# Altium project UPS.PrjPCB
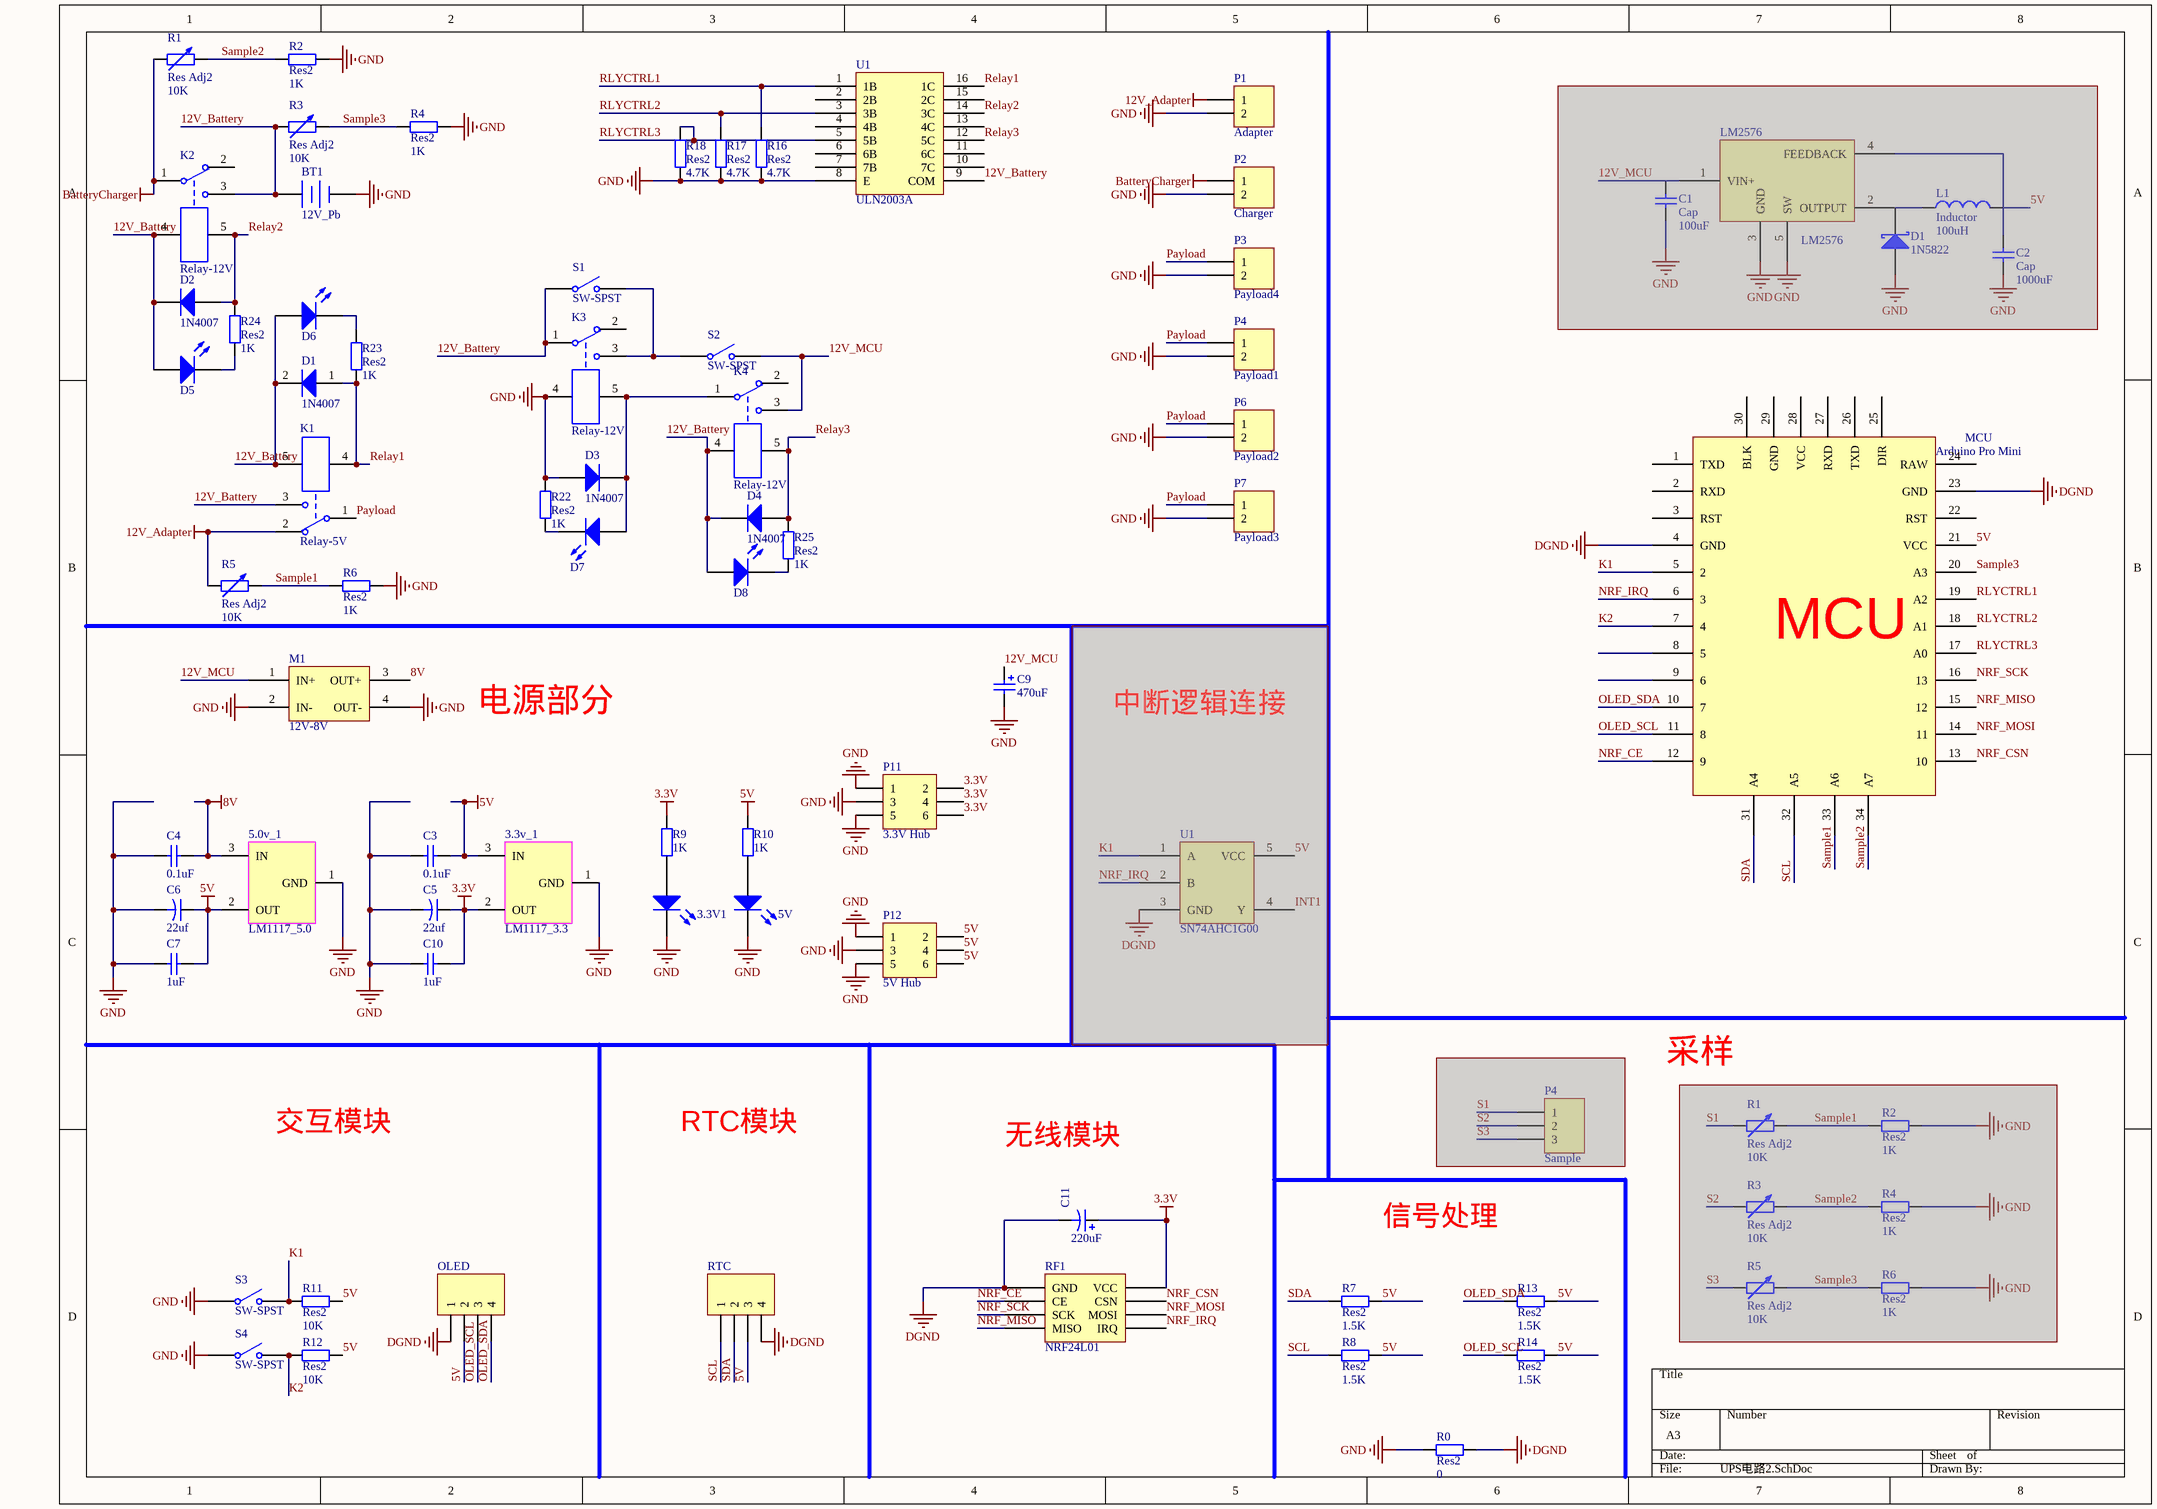
[diagram p0: UPS电路2.SchDoc]
1 sheet, 78 parts. Net scope: global (net labels, ports and power ports of the same name join across sheets).
Board file: UPS电路3.PcbDoc

## Sheet UPS电路2.SchDoc
size A3

### Parts
(Parts that share a designator on the sheet are numbered #1, #2 ... from top to bottom, then left to right.)
3.3V1  3.3V1  [LED]  (value not drawn)
3.3v_1  LM1117_3.3  [LC-SOT-223]
5.0v_1  LM1117_5.0  [LC-SOT-223]
5V  3.3V1  [LED]  (value not drawn)
BT1  12V_Pb  [BIG2]
C1  Cap  value 100uF  [RAD-0.3]  (masked out: inside a compile mask, not in the netlist)
C2  Cap  value 1000uF  [RAD-0.3]  (masked out: inside a compile mask, not in the netlist)
C3  0.1uF  [0805]
C4  0.1uF  [0805]
C5  22uf  [LC-CASE-B_3528]
C6  22uf  [LC-CASE-B_3528]
C7  1uF  [0805]
C9  470uF  [470uf-2]
C10  1uF  [0805]
C11  220uF  [220uf]
D1#1  1N5822  [TO-220AC]  (masked out: inside a compile mask, not in the netlist)
D1#2  1N4007  [m7(1n4007)]
D2  1N4007  [m7(1n4007)]
D3  1N4007  [m7(1n4007)]
D4  1N4007  [m7(1n4007)]
D5  3.3V1  [LED]  (value not drawn)
D6  3.3V1  [LED]  (value not drawn)
D7  3.3V1  [LED]  (value not drawn)
D8  3.3V1  [LED]  (value not drawn)
K1  Relay-5V  [SRD_12VDC_SL_C]
K2  Relay-12V  [SRD_12VDC_SL_C]
K3  Relay-12V  [SRD_12VDC_SL_C]
K4  Relay-12V  [SRD_12VDC_SL_C]
L1  Inductor  value 100uH  [0402-A]  (masked out: inside a compile mask, not in the netlist)
LM2576  LM2576  (masked out: inside a compile mask, not in the netlist)
M1  12V-8V  [LM2596]
MCU  Arduino Pro Mini  [Arduino_Promini]
OLED  Header 4  [HDR1X4]  (value not drawn)
P1  Adapter  [BIG2]
P2  Charger  [BIG2]
P3  Payload4  [BIG2]
P4#1  Payload1  [BIG2]
P4#2  Sample  [HDR1X3]  (masked out: inside a compile mask, not in the netlist)
P6  Payload2  [BIG2]
P7  Payload3  [BIG2]
P11  3.3V Hub  [HDR2X3]
P12  5V Hub  [HDR2X3]
R0  Res2  value 0  [0805]
R1#1  Res Adj2  value 10K  [0805]
R1#2  Res Adj2  value 10K  [AdjRes]  (masked out: inside a compile mask, not in the netlist)
R2#1  Res2  value 1K  [0805]
R2#2  Res2  value 1K  [0805]  (masked out: inside a compile mask, not in the netlist)
R3#1  Res Adj2  value 10K  [0805]
R3#2  Res Adj2  value 10K  [AdjRes]  (masked out: inside a compile mask, not in the netlist)
R4#1  Res2  value 1K  [0805]
R4#2  Res2  value 1K  [0805]  (masked out: inside a compile mask, not in the netlist)
R5#1  Res Adj2  value 10K  [0805]
R5#2  Res Adj2  value 10K  [AdjRes]  (masked out: inside a compile mask, not in the netlist)
R6#1  Res2  value 1K  [0805]
R6#2  Res2  value 1K  [0805]  (masked out: inside a compile mask, not in the netlist)
R7  Res2  value 1.5K  [0805]
R8  Res2  value 1.5K  [0805]
R9  1K  [0805]
R10  1K  [0805]
R11  Res2  value 10K  [0805]
R12  Res2  value 10K  [0805]
R13  Res2  value 1.5K  [0805]
R14  Res2  value 1.5K  [0805]
R16  Res2  value 4.7K  [0805]
R17  Res2  value 4.7K  [0805]
R18  Res2  value 4.7K  [0805]
R22  Res2  value 1K  [0805]
R23  Res2  value 1K  [0805]
R24  Res2  value 1K  [0805]
R25  Res2  value 1K  [0805]
RF1  NRF24L01  [NRF24L01]
RTC  Header 4  [HDR1X4]  (value not drawn)
S1  SW-SPST  [SWITCH6*6*5]
S2  SW-SPST  [Swtich7*7]
S3  SW-SPST  [SWITCH6*6*5]
S4  SW-SPST  [SWITCH6*6*5]
U1#1  ULN2003A  [ULN2003-DIP16]
U1#2  SN74AHC1G00  (masked out: inside a compile mask, not in the netlist)

### Nets
3.3V: 3.3v_1.2(OUT) C5.1 C10.2 C11.1 P11.2 P11.4 P11.6 R9.2 RF1.2(VCC)
5V: 3.3v_1.3(IN) 5.0v_1.2(OUT) C3.2 C6.1 C7.2 MCU.21(VCC) OLED.2 P12.2 P12.4 P12.6 R7.2 R8.2 R10.2 R11.1 R12.1 R13.2 R14.2 RTC.3
8V: 5.0v_1.3(IN) C4.2 M1.3(OUT+)
12V_Adapter: K1.2 P1.1 R5#1.1
BatteryCharger: K2.1 P2.1 R1#1.1
DGND: C11.2 MCU.4(GND) MCU.23(GND) OLED.1 R0.2 RF1.1(GND) RTC.4
GND: 3.3V1.2(K) 3.3v_1.1(GND) 5.0v_1.1(GND) 5V.2(K) BT1.2(-) C3.1 C4.1 C5.2 C6.2 C7.1 C9.2 C10.1 D3.1(A) K3.4 M1.2(IN-) M1.4(OUT-) P1.2 P2.2 P3.2 P4#1.2 P6.2 P7.2 P11.1 P11.3 P11.5 P12.1 P12.3 P12.5 R0.1 R2#1.2 R4#1.2 R6#1.2 R16.1 R17.1 R18.1 R22.2 S3.1(COMMON) S4.1(COMMON) U1#1.8(E)
12V_Battery: BT1.1(+) D1#2.2(K) D2.2(K) D4.2(K) D5.1(A) D6.1(A) D8.1(A) K1.3 K1.5 K2.3 K2.4 K3.1 K4.4 R3#1.1 S1.1(COMMON) U1#1.9(COM)
12V_MCU: C9.1 K4.3 M1.1(IN+) S2.2(NO)
K1: MCU.5(2) R11.2 S3.2(NO)
K2: MCU.7(4) R12.2 S4.2(NO)
NRF_CE: MCU.12(9) RF1.3(CE)
NRF_CSN: MCU.13(10) RF1.4(CSN)
NRF_IRQ: MCU.6(3) RF1.8(IRQ)
NRF_MISO: MCU.15(12) RF1.7(MISO)
NRF_MOSI: MCU.14(11) RF1.6(MOSI)
NRF_SCK: MCU.16(13) RF1.5(SCK)
OLED_SCL: MCU.11(8) OLED.3 R14.1
OLED_SDA: MCU.10(7) OLED.4 R13.1
Payload: K1.1 P3.1 P4#1.1 P6.1 P7.1
Relay1: D1#2.1(A) K1.4 R23.1 U1#1.16(1C)
Relay2: D2.1(A) K2.5 R24.2 U1#1.14(3C)
Relay3: D4.1(A) K4.5 R25.2 U1#1.12(5C)
RLYCTRL1: MCU.19(A2) R16.2 U1#1.1(1B)
RLYCTRL2: MCU.18(A1) R17.2 U1#1.3(3B)
RLYCTRL3: MCU.17(A0) R18.2 U1#1.5(5B)
Sample1: MCU.33(A6) R5#1.2 R6#1.1
Sample2: MCU.34(A7) R1#1.2 R2#1.1
Sample3: MCU.20(A3) R3#1.2 R4#1.1
SCL: MCU.32(A5) R8.1 RTC.1
SDA: MCU.31(A4) R7.1 RTC.2
Net3.3V1_1: 3.3V1.1(A) R9.1
Net5V_1: 5V.1(A) R10.1
NetD3_2: D3.2(K) D7.1(A) K3.5 K4.1
NetD5_2: D5.2(K) R24.1
NetD6_2: D6.2(K) R23.2
NetD7_2: D7.2(K) R22.1
NetD8_2: D8.2(K) R25.1
NetK3_3: K3.3 S1.2(NO) S2.1(COMMON)

Not connected (* = marked no-connect by the designer): K2 2; K3 2; K4 2; MCU 1(TXD) 2(RXD) 3(RST) 8(5) 9(6) 22(RST) 24(RAW) 25(DIR) 26(TXD) 27(RXD) 28(VCC) 29(GND) 30(BLK); U1#1 2(2B) 4(4B) 6(6B) 7(7B) 10(7C) 11(6C) 13(4C) 15(2C)

### Notes on the sheet
- (near MCU) MCU
- 电源部分
- 中断逻辑连接
- 采样
- 交互模块
- RTC模块
- 无线模块
- 信号处理

### Library data of the parts
3.3V1 5V D5-D8 = LED: Typical RED, GREEN, YELLOW, AMBER GaAs LED; Published: 8-Jun-2000; LatestRevisionDate: 17-Jul-2002; LatestRevisionNote: Re-released for DXP Platform.; PackageDocument: Feb-2002; PackageReference: 3.2X1.6X1.1; Publisher: Altium Limited
3.3v_1 5.0v_1 = LM1117
BT1 = Battery: Multicell Battery; Published: 24-Mar-1999; LatestRevisionDate: 17-Jul-2002; LatestRevisionNote: Re-released for DXP Platform.; PackageReference: BAT-2; Publisher: Altium Limited; PackageDescription: Battery; 2 Leads
C1 C2 = Cap: Capacitor; Published: 8-Jun-2000; LatestRevisionDate: 17-Jul-2002; LatestRevisionNote: Re-released for DXP Platform.; PackageReference: RAD-0.3; Publisher: Altium Limited; PackageDescription: Radial Cap, Thru-Hole; 2 Leads; 0.3 in Pin Spacing
C3 C4 C7 C10 = cap: Capacitor
C5 C6 = Cap2: Capacitor; Value: 0.1uF; Published: 23-Sep-2002; Publisher: Altium Limited
C9 = Cap Pol2: Polarized Capacitor (Axial); Value: 47uF; Published: 8-Jun-2000; LatestRevisionDate: 17-Jul-2002; LatestRevisionNote: Re-released for DXP Platform.; Publisher: Altium Limited
C11 = Cap Pol1: Polarized Capacitor (Radial); Value: 10uF; Published: 8-Jun-2000; LatestRevisionDate: 17-Jul-2002; LatestRevisionNote: Re-released for DXP Platform.; Publisher: Altium Limited
D1#1 = Diode 10TQ035: Schottky Rectifier; Note: Terminal 2 is the TAB and is electrically connected to the cathode; Published: 8-Jun-2000; LatestRevisionDate: 17-Jul-2002; LatestRevisionNote: Re-released for DXP Platform.; DatasheetVersion: PD-2.057B; PackageVersion: Feb-1998; PackageReference: TO-220AC; Publisher: Altium Limited; PackageDescription: TO, Thru-Hole, Vertical, Heatsink Mounted; 3 In-Line Leads (1 Absent); Pitch 2.54 mm; ComponentLink1Description: Manufacturer Link; ComponentLink1URL: http://www.irf.com/; ComponentLink2Description: Datasheet; ComponentLink2URL: http://www.irf.com/product-info/datasheets/data/10tq.pdf
D1#2 D2-D4 = Diode 1N4007: 1 Amp General Purpose Rectifier; Published: 8-Jun-2000; LatestRevisionDate: 17-Jul-2002; LatestRevisionNote: Re-released for DXP Platform.; DatasheetVersion: 1998; PackageVersion: Aug-1999; PackageReference: DO-41; Publisher: Altium Limited; PackageDescription: Diode, Axial; Body 5.2 x 2.7 mm (LxDia. max), Lead Dia. 0.86 mm (max); Code_JEDEC: DO-204-AL; ComponentLink1Description: Manufacturer Link; ComponentLink1URL: http://www.fairchildsemi.com/; ComponentLink2Description: Datasheet; ComponentLink2URL: http://www.fairchildsemi.com/ds/1N%2F1N4001.pdf
K1-K4 = Relay-SPDT: Single-Pole Dual-Throw Relay; Published: 24-Mar-1999; LatestRevisionDate: 17-Jul-2002; LatestRevisionNote: Re-released for DXP Platform.; PackageReference: MODULE5B; Publisher: Altium Limited
L1 = Inductor: Code_IEC: 1005; Published: 8-Jun-2000; LatestRevisionDate: 29-May-2009; LatestRevisionNote: IPC-7351 Footprint Added.; PackageReference: 0402-A; Publisher: Altium Limited; PackageDescription: Chip Inductor; Code_JEITA: 0402
M1 = 12V-5V
OLED RTC = Header 4: Header, 4-Pin; LatestRevisionDate: 17-Jul-2002; LatestRevisionNote: Re-released for DXP Platform.; Publisher: Altium Limited
P1-P3 P4#1 P6 P7 = Header 2: Header, 2-Pin; LatestRevisionDate: 17-Jul-2002; LatestRevisionNote: Re-released for DXP Platform.; Publisher: Altium Limited
P4#2 = Header 3: Header, 3-Pin; LatestRevisionDate: 17-Jul-2002; LatestRevisionNote: Re-released for DXP Platform.; Publisher: Altium Limited
P11 P12 = Header 3X2: Header, 3-Pin, Dual row; LatestRevisionDate: 17-Jul-2002; LatestRevisionNote: Re-released for DXP Platform.; Publisher: Altium Limited
R0 R2#1 R2#2 R4#1 R4#2 R6#1 R6#2 R7 R8 R11-R14 R16-R18 R22-R25 = Res2: Resistor; Published: 8-Jun-2000; LatestRevisionDate: 17-Jul-2002; LatestRevisionNote: Re-released for DXP Platform.; PackageReference: AXIAL-0.4; Publisher: Altium Limited; PackageDescription: Axial Device, Thru-Hole; 2 Leads; 0.4 in Pin Spacing
R1#1 R1#2 R3#1 R3#2 R5#1 R5#2 = Res Adj2: Variable Resistor; Set Position: 0.5; Published: 8-Jun-2000; LatestRevisionDate: 17-Jul-2002; LatestRevisionNote: Re-released for DXP Platform.; PackageReference: AXIAL-0.6; Publisher: Altium Limited; PackageDescription: Axial Device, Thru-Hole; 2 Leads; 0.6 in Pin Spacing
R9 R10 = RES2_1: Resistor
S1-S4 = SW-SPST: Single-Pole, Single-Throw Switch; Published: 24-Mar-1999; LatestRevisionDate: 17-Jul-2002; LatestRevisionNote: Re-released for DXP Platform.; PackageReference: SPST-2; Publisher: Altium Limited; PackageDescription: Switch; 2 Leads
U1#2 = SN74LVC1G32